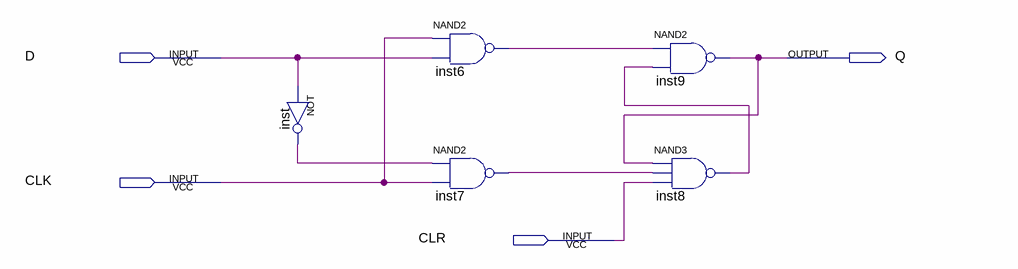
[diagram p0: schematic sheet]
// Quartus schematic D_FF_CLR.bdf as structural Verilog: 5 symbols, 4 pins
module D_FF_CLR (
  input  D,
  input  CLK,
  input  CLR,
  output Q
);

  wire inst6_out, inst7_out, inst8_out, inst_out;

  not inst (inst_out, D);
  nand inst6 (inst6_out, CLK, D);
  nand inst7 (inst7_out, inst_out, CLK);
  nand inst9 (Q, inst6_out, inst8_out);
  nand inst8 (inst8_out, Q, inst7_out, CLR);
endmodule
